# Altium schematic sheet LHC.SchDoc
size Legal
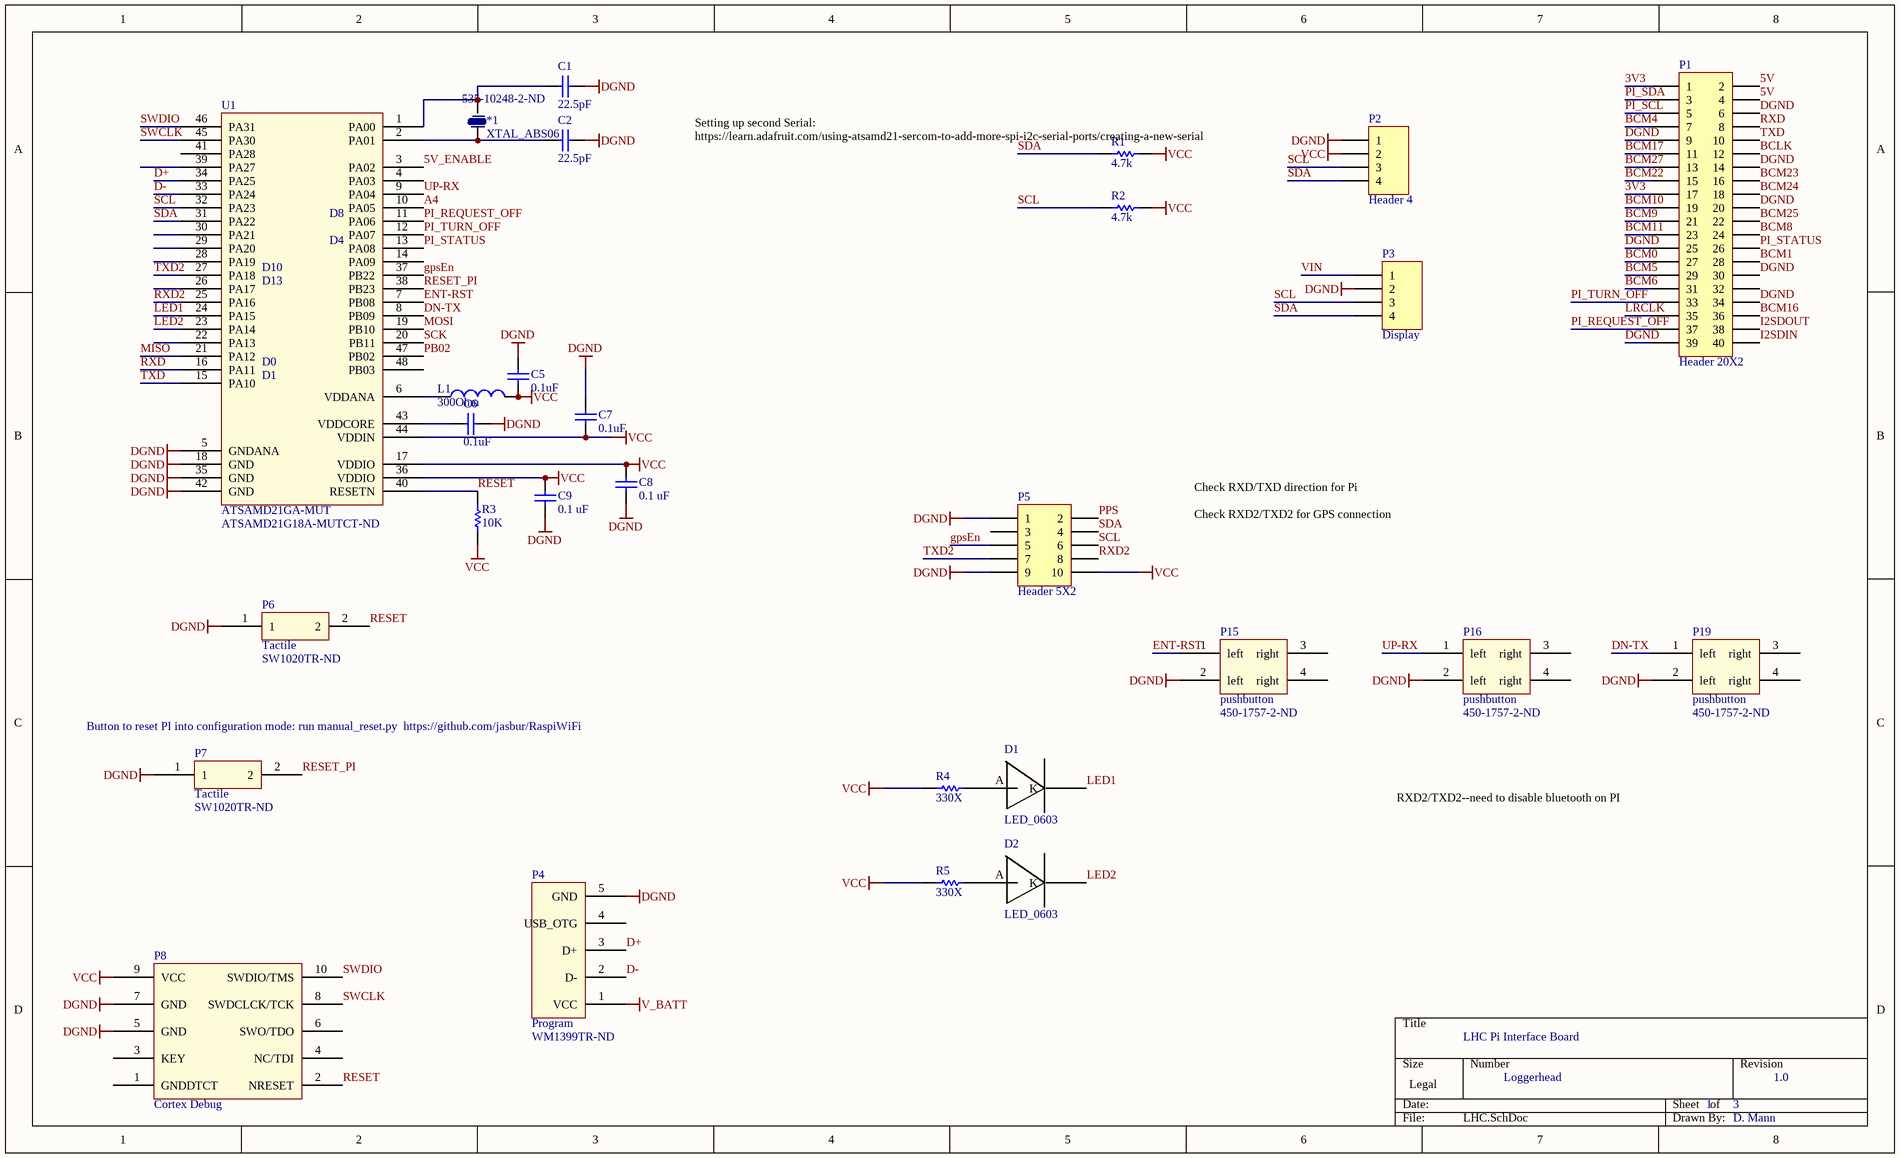
[diagram p0: LHC.SchDoc]

## Parts
*1  XTAL_ABS06  Supplier Part Number 1: 535-10248-2-ND  [XTAL-ABS06]
C1  22.5pF  [0402]
C2  22.5pF  [0402]
C5  0.1uF  [0402]
C6  0.1uF  [0402]
C7  0.1uF  [0402]
C8  0.1 uF  [0402]
C9  0.1 uF  [0402]
D1  LED_0603  [Diode0603]
D2  LED_0603  [Diode0603]
L1  300Ohm  [0805 (M2125) Ferrite]
P1  Header 20X2  [HDR2X20]
P2  Header 4  [HDR1X4]
P3  Display  [HDR1X4]
P4  Program  Supplier Part Number 1: WM1399TR-ND  [microUSB-B]
P5  Header 5X2  [HDR2X5]
P6  Tactile  Supplier Part Number 1: SW1020TR-ND  [Tactile-B3U-1000]
P7  Tactile  Supplier Part Number 1: SW1020TR-ND  [Tactile-B3U-1000]
P8  Cortex Debug  [Header_2x5_50mil]
P15  pushbutton  Supplier Part Number 1: 450-1757-2-ND  [SOP4]
P16  pushbutton  Supplier Part Number 1: 450-1757-2-ND  [SOP4]
P19  pushbutton  Supplier Part Number 1: 450-1757-2-ND  [SOP4]
R1  4.7k  [3-0603]
R2  4.7k  [3-0603]
R3  10K  [3-0603]
R4  330X  [3-0603]
R5  330X  [3-0603]
U1  ATSAMD21GA-MUT  Supplier Part Number 1: ATSAMD21G18A-MUTCT-ND  [QFN127P600-8N]

## Nets
DGND: C1.1 C2.1 C5.2 C6.2 C7.2 C8.2 C9.2 P1.6 P1.9 P1.14 P1.20 P1.25 P1.30 P1.34 P1.39 P2.1 P3.2 P4.5(GND) P5.1 P5.9 P6.1 P7.1 P8.5(GND) P8.7(GND) P15.2(left) P16.2(left) P19.2(left) U1.5(GNDANA) U1.18(GND) U1.35(GND) U1.42(GND)
V_BATT: P4.1(VCC)
VCC: C5.1 C7.1 C8.1 C9.1 L1.2 P2.2 P5.10 P8.9(VCC) R1.2 R2.2 R3.1 R4.1 R5.1 U1.17(VDDIO) U1.36(VDDIO) U1.44(VDDIN)
3V3: P1.1 P1.17
5V: P1.2 P1.4
5V_ENABLE: U1.3(PA02)
A4: U1.10(PA05)
BCLK: P1.12
BCM0: P1.27
BCM1: P1.28
BCM4: P1.7
BCM5: P1.29
BCM6: P1.31
BCM8: P1.24
BCM9: P1.21
BCM10: P1.19
BCM11: P1.23
BCM16: P1.36
BCM17: P1.11
BCM22: P1.15
BCM23: P1.16
BCM24: P1.18
BCM25: P1.22
BCM27: P1.13
D+: P4.3(D+) U1.34(PA25)
D-: P4.2(D-) U1.33(PA24)
DN-TX: P19.1(left) U1.8(PB09)
ENT-RST: P15.1(left) U1.7(PB08)
gpsEn: P5.5 U1.37(PB22)
I2SDIN: P1.40
I2SDOUT: P1.38
LED1: D1.K U1.24(PA15)
LED2: D2.K U1.23(PA14)
LRCLK: P1.35
MISO: U1.21(PA12)
MOSI: U1.19(PB10)
PB02: U1.47(PB02)
PI_REQUEST_OFF: P1.37 U1.11(PA06)
PI_SCL: P1.5
PI_SDA: P1.3
PI_STATUS: P1.26 U1.13(PA08)
PI_TURN_OFF: P1.33 U1.12(PA07)
PPS: P5.2
RESET: P6.2 P8.2(NRESET) R3.2 U1.40(RESETN)
RESET_PI: P7.2 U1.38(PB23)
RXD: P1.8 U1.16(PA11)
RXD2: P5.8 U1.25(PA16)
SCK: U1.20(PB11)
SCL: P2.3 P3.3 P5.6 R2.1 U1.32(PA23)
SDA: P2.4 P3.4 P5.4 R1.1 U1.31(PA22)
SWCLK: P8.8(SWDCLCK/TCK) U1.45(PA30)
SWDIO: P8.10(SWDIO/TMS) U1.46(PA31)
TXD: P1.10 U1.15(PA10)
TXD2: P5.7 U1.27(PA18)
UP-RX: P16.1(left) U1.9(PA04)
VIN: P3.1
Net*1_1: *1.1 C2.2 U1.2(PA01)
Net*1_2: *1.2 C1.2 U1.1(PA00)
NetC6_1: C6.1 U1.43(VDDCORE)
NetD1_A: D1.A R4.2
NetD2_A: D2.A R5.2
NetL1_1: L1.1 U1.6(VDDANA)

Not connected (* = marked no-connect by the designer): P1 32; P4 4(USB_OTG); P5 3; P8 1(GNDDTCT) 3(KEY) 4(NC/TDI) 6(SWO/TDO); P15 3(right) 4(right); P16 3(right) 4(right); P19 3(right) 4(right); U1 4(PA03) 14(PA09) 22(PA13) 26(PA17) 28(PA19) 29(PA20) 30(PA21) 39(PA27) 41(PA28) 48(PB03)

## Notes on the sheet
- (near U1) D8
- (near U1) D10
- (near U1) D13
- (near U1) D4
- Setting up second Serial: https://learn.adafruit.com/using-atsamd21-sercom-to-add-more-spi-i2c-serial-ports/creating-a-new-serial
- (near U1) D0
- (near U1) D1
- Check RXD/TXD direction for Pi
  Check RXD2/TXD2 for GPS connection
- (near P7) Button to reset PI into configuration mode: run manual_reset.py  https://github.com/jasbur/RaspiWiFi
- RXD2/TXD2--need to disable bluetooth on PI
- LHC Pi Interface Board
- Loggerhead
- 1
- 3
- 1.0
- D. Mann

## Library data of the parts
C1 C2 = C0402: Ceramic Chip Capacitor - Standard; Note: Footprint corresponds to dimensions for bulk cassette packaging. This case size has tightened tolerances.; Value: 12.5; Published: 17-Jul-2002; LatestRevisionDate: 19-Mar-2004; LatestRevisionNote: Silkscreen size reduced.; DatasheetDocument: Mar-2001; PackageDocument: Mar-2001; PackageReference: 0402; Publisher: Altium Limited; Code_JEITA: 0402; Code_IPC: 1005 [0402]; ComponentLink1Description: Manufacturer Link; ComponentLink1URL: http://www.kemet.com/; ComponentLink2Description: Datasheet; ComponentLink2URL: http://www.kemet.com/kemet/web/homepage/kechome.nsf/vapubfilesname/F3102TA.pdf/$file/F3102TA.pdf
C5-C7 = C0402: Ceramic Chip Capacitor - Standard; Note: Footprint corresponds to dimensions for bulk cassette packaging. This case size has tightened tolerances.; Published: 17-Jul-2002; LatestRevisionDate: 19-Mar-2004; LatestRevisionNote: Silkscreen size reduced.; DatasheetDocument: Mar-2001; PackageDocument: Mar-2001; PackageReference: 0402; Publisher: Altium Limited; Code_JEITA: 0402; Code_IPC: 1005 [0402]; ComponentLink1Description: Manufacturer Link; ComponentLink1URL: http://www.kemet.com/; ComponentLink2Description: Datasheet; ComponentLink2URL: http://www.kemet.com/kemet/web/homepage/kechome.nsf/vapubfilesname/F3102TA.pdf/$file/F3102TA.pdf; Value: 0.1uF
C8 C9 = C0402: Ceramic Chip Capacitor - Standard; Note: Footprint corresponds to dimensions for bulk cassette packaging. This case size has tightened tolerances.; Value: 0.1uF; Published: 17-Jul-2002; LatestRevisionDate: 19-Mar-2004; LatestRevisionNote: Silkscreen size reduced.; DatasheetDocument: Mar-2001; PackageDocument: Mar-2001; PackageReference: 0402; Publisher: Altium Limited; Code_JEITA: 0402; Code_IPC: 1005 [0402]; ComponentLink1Description: Manufacturer Link; ComponentLink1URL: http://www.kemet.com/; ComponentLink2Description: Datasheet; ComponentLink2URL: http://www.kemet.com/kemet/web/homepage/kechome.nsf/vapubfilesname/F3102TA.pdf/$file/F3102TA.pdf
L1 = Ferrite 0805(M2125) 3A: Ferrite 25mOhm@DC,  60 Ohm@100MHz; Fabrication Tested: NO; Creator and Date: Design Engineer's Name; Footprint Verified By: *; Schematic Verified By: *; Vendor Info Verified By: *; Value: 300Ohm; HelpURL: http://www.yuden.co.jp/ut/product/pdf/mlci08_e.pdf; Mass (place origin at center): *; Supplier 1: Digi-Key; Supplier Part Number 1: 587-1932-1-ND; Supplier 2: Newark; Supplier Part Number 2: 73M9170
P1 = Header 20X2: Header, 20-Pin, Dual row; LatestRevisionDate: 17-Jul-2002; LatestRevisionNote: Re-released for DXP Platform.; Publisher: Altium Limited
P2 P3 = Header 4: Header, 4-Pin; LatestRevisionDate: 17-Jul-2002; LatestRevisionNote: Re-released for DXP Platform.; Publisher: Altium Limited
P4 = microUSB-B: Supplier 1: Digi-Key
P5 = Header 5X2: Header, 5-Pin, Dual row; LatestRevisionDate: 17-Jul-2002; LatestRevisionNote: Re-released for DXP Platform.; Publisher: Altium Limited
P6 P7 = Tactile_B3U-1000: Supplier 1: Digi-Key
P8 = CortexDebug
R1-R5 = ERJ3RK: Precision Thick Film Chip Resistor, 10 Ohm to 1M Ohm Range, 1% and 0.5% Tolerance, 0603 Size, 0.063 W; Published: 17-Dec-2003; LatestRevisionDate: 19-Mar-2004; LatestRevisionNote: Silkscreen size reduced.; PackageDocument: Mar-2003; PackageReference: 3-0603; Publisher: Altium Limited; Code_IPC: 1608 [0603]; ComponentLink1Description: Manufacturer Link; ComponentLink1URL: http://www.panasonic.com/industrial/components/resistive_products.htm; ComponentLink2Description: Datasheet; ComponentLink2URL: http://www.panasonic.com/industrial/components/pdf/AOA0000CE2.pdf
U1 = ATSAMD21G18: Supplier 1: Digi-Key
*1 = XTAL_ABS06: Supplier 1: Digi-Key
P15 P16 P19 = pushbutton: Supplier 1: Digi-Key